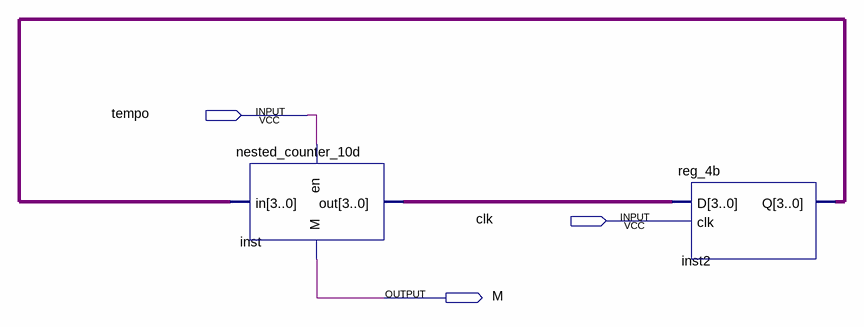
[diagram p0: schematic sheet]
// Quartus schematic nested_counter_timer_10d.bdf as structural Verilog: 2 symbols, 3 pins
module nested_counter_timer_10d (
  input  tempo,
  input  clk,
  output M
);

  wire [3:0] inst2_q, inst_out;

  nested_counter_10d inst (.en(tempo), .in(inst2_q), .out(inst_out), .M(M));
  reg_4b inst2 (.D(inst_out), .clk(clk), .Q(inst2_q));
endmodule
